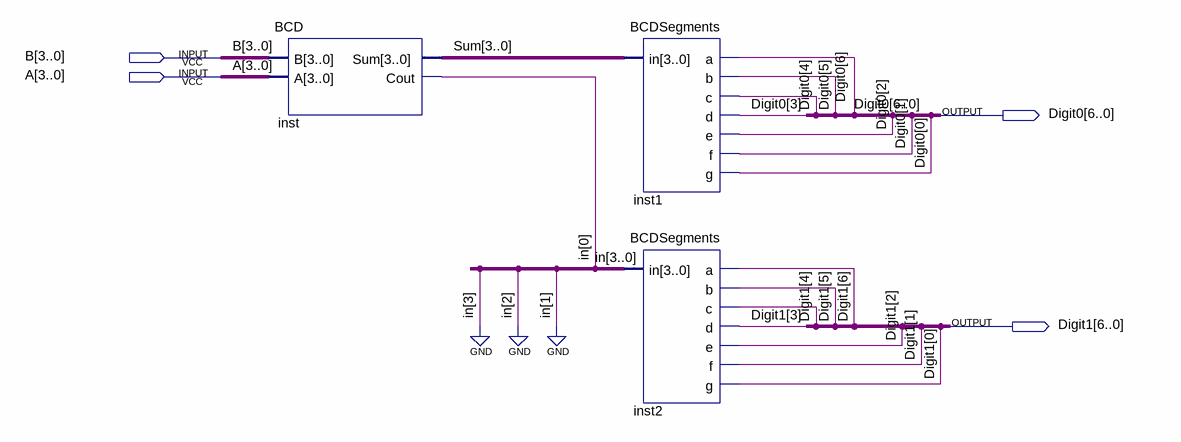
[diagram p0: schematic sheet]
// Quartus schematic BCDComplete.bdf as structural Verilog: 3 symbols, 4 pins
module BCDComplete (
  input  [3:0] B,
  input  [3:0] A,
  output [6:0] Digit0,
  output [6:0] Digit1
);

  wire [0:0] in;
  wire [3:0] Sum;

  BCD inst (.B(B), .A(A), .Sum(Sum), .Cout(in[0]));
  BCDSegments inst1 (
    .in(Sum), .a(Digit0[6]), .b(Digit0[5]), .c(Digit0[4]), .d(Digit0[3]), .e(Digit0[2]), .f(Digit0[1]),
    .g(Digit0[0]));
  BCDSegments inst2 (
    .in({3'b000, in[0]}), .a(Digit1[6]), .b(Digit1[5]), .c(Digit1[4]), .d(Digit1[3]), .e(Digit1[2]),
    .f(Digit1[1]), .g(Digit1[0]));
endmodule
